# Altium schematic sheet 10_Clock_data_ref.SchDoc: Clock data reference
size A3; Organization: Lime Microsystems; Address1: Surrey Tech Centre; Address2: Guildford GU2 7YG; Address3: Surrey; Address4: United Kingdom; Revision: v1.0; SheetNumber: 10; SheetTotal: 11
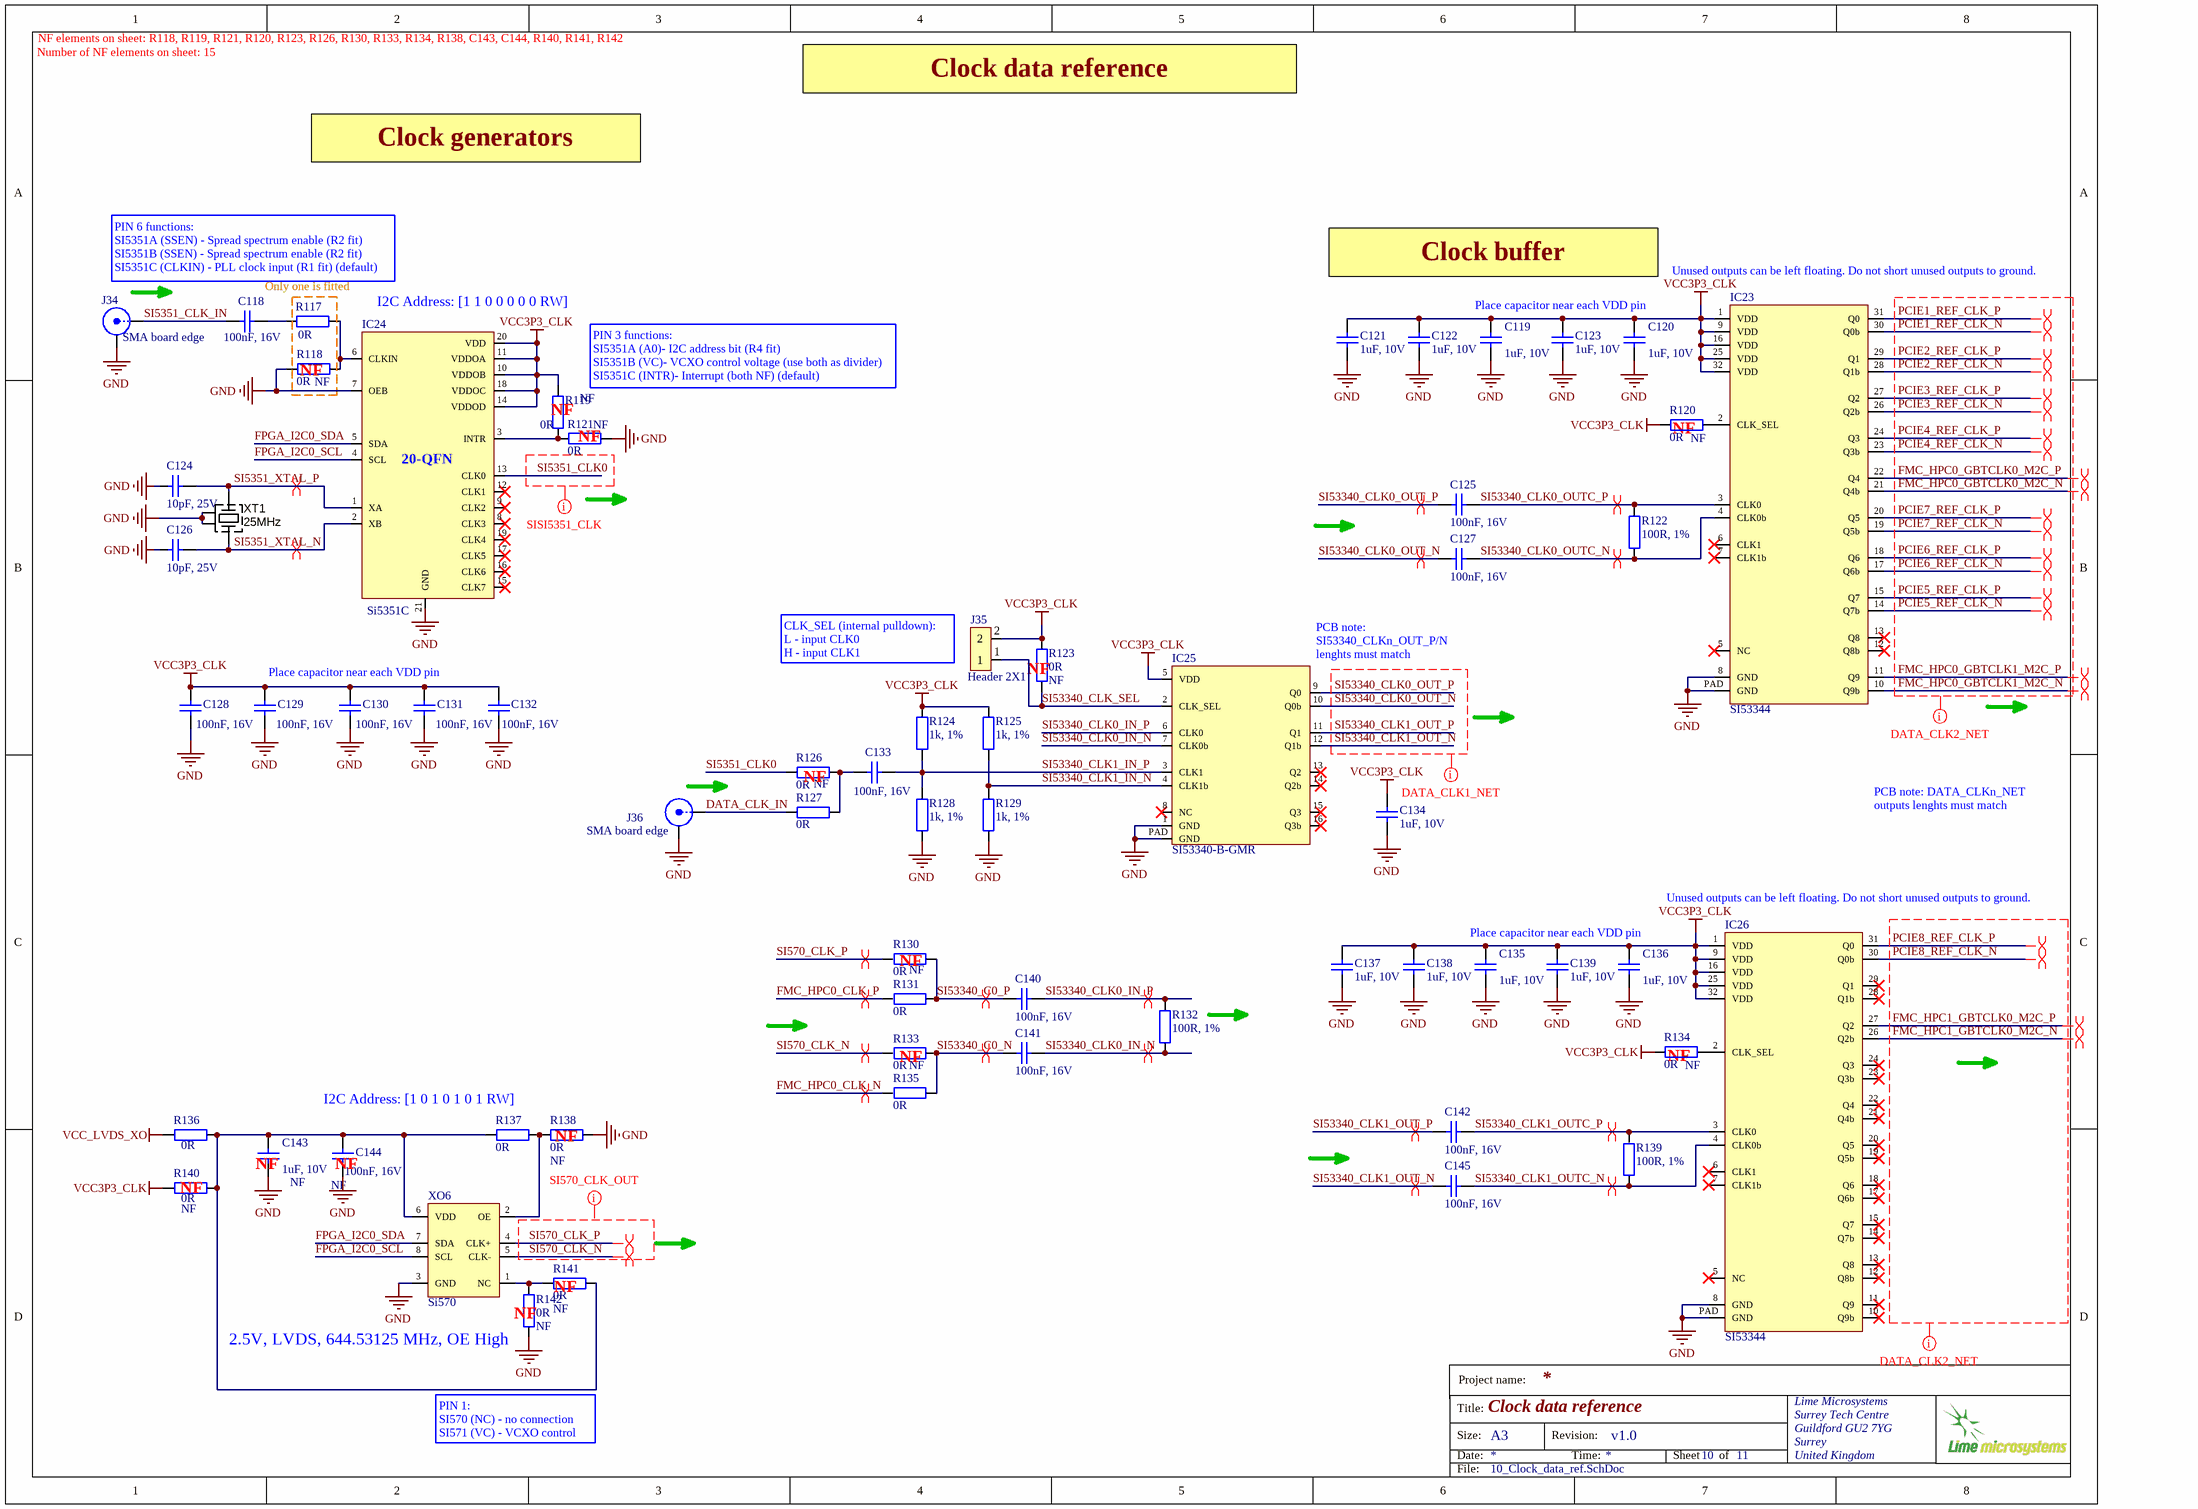
[diagram p0: 10_Clock_data_ref.SchDoc]

## Parts
C118  100nF, 16V  [CAP0402]
C119  1uF, 10V  [CAP0402]
C120  1uF, 10V  [CAP0402]
C121  1uF, 10V  [CAP0402]
C122  1uF, 10V  [CAP0402]
C123  1uF, 10V  [CAP0402]
C124  10pF, 25V  [CAP0402]
C125  100nF, 16V  [CAP0402]
C126  10pF, 25V  [CAP0402]
C127  100nF, 16V  [CAP0402]
C128  100nF, 16V  [CAP0402]
C129  100nF, 16V  [CAP0402]
C130  100nF, 16V  [CAP0402]
C131  100nF, 16V  [CAP0402]
C132  100nF, 16V  [CAP0402]
C133  100nF, 16V  [CAP0402]
C134  1uF, 10V  [CAP0402]
C135  1uF, 10V  [CAP0402]
C136  1uF, 10V  [CAP0402]
C137  1uF, 10V  [CAP0402]
C138  1uF, 10V  [CAP0402]
C139  1uF, 10V  [CAP0402]
C140  100nF, 16V  [CAP0402]
C141  100nF, 16V  [CAP0402]
C142  100nF, 16V  [CAP0402]
C143  1uF, 10V  Assembly Info: NF  [CAP0402]
C144  100nF, 16V  Assembly Info: NF  [CAP0402]
C145  100nF, 16V  [CAP0402]
IC23  SI53344  [SI53344-B-GM_32-VFQFN]
IC24  Si5351C  [Si5351C_20QFN]
IC25  SI53340-B-GMR  [SI53340_QFN16]
IC26  SI53344  [SI53344-B-GM_32-VFQFN]
J34  SMA board edge  [SMA_connector_board_edge_SM]
J35  Header 2X1  [HDR_1x2]
J36  SMA board edge  [SMA_connector_board_edge_SM]
R117  0R  [RES0402]
R118  0R  Assembly Info: NF  [RES0402]
R119  0R  Assembly Info: NF  [RES0402]
R120  0R  Assembly Info: NF  [RES0402]
R121  0R  Assembly Info: NF  [RES0402]
R122  100R, 1%  [RES0402]
R123  0R  Assembly Info: NF  [RES0402]
R124  1k, 1%  [RES0402]
R125  1k, 1%  [RES0402]
R126  0R  Assembly Info: NF  [RES0402]
R127  0R  [RES0402]
R128  1k, 1%  [RES0402]
R129  1k, 1%  [RES0402]
R130  0R  Assembly Info: NF  [RES0402]
R131  0R  [RES0402]
R132  100R, 1%  [RES0402]
R133  0R  Assembly Info: NF  [RES0402]
R134  0R  Assembly Info: NF  [RES0402]
R135  0R  [RES0402]
R136  0R  [RES0402]
R137  0R  [RES0402]
R138  0R  Assembly Info: NF  [RES0402]
R139  100R, 1%  [RES0402]
R140  0R  Assembly Info: NF  [RES0402]
R141  0R  Assembly Info: NF  [RES0402]
R142  0R  Assembly Info: NF  [RES0402]
XO6  Si570  [Si570_Si571_CRYSTAL_8SMD]
XT1  25MHz  [CRYSTAL_4-LCC]

## Nets
GND: C119.1 C120.1 C121.2 C122.2 C123.2 C124.1 C126.1 C128.2 C129.2 C130.2 C131.2 C132.2 C134.2 C135.1 C136.1 C137.2 C138.2 C139.2 C143.1 C144.2 IC23.8(GND) IC23.PAD(GND) IC24.7(OEB) IC24.21(GND) IC25.1(GND) IC25.PAD(GND) IC26.8(GND) IC26.PAD(GND) J34.2(Y) J36.2(Y) R118.2 R121.2 R128.1 R129.1 R138.1 R142.1 XO6.3(GND) XT1.2(GND) XT1.4(GND)
VCC3P3_CLK: C119.2 C120.2 C121.1 C122.1 C123.1 C128.1 C129.1 C130.1 C131.1 C132.1 C134.1 C135.2 C136.2 C137.1 C138.1 C139.1 IC23.1(VDD) IC23.9(VDD) IC23.16(VDD) IC23.25(VDD) IC23.32(VDD) IC24.10(VDDOB) IC24.11(VDDOA) IC24.14(VDDOD) IC24.18(VDDOC) IC24.20(VDD) IC25.5(VDD) IC26.1(VDD) IC26.9(VDD) IC26.16(VDD) IC26.25(VDD) IC26.32(VDD) J35.2 R119.2 R120.1 R123.1 R124.1 R125.1 R134.1 R140.2
VCC_LVDS_XO: R136.2
DATA_CLK_IN: J36.1(X) R127.2
FMC_HPC0_CLK_N: R135.2
FMC_HPC0_CLK_P: R131.2
FMC_HPC0_GBTCLK0_M2C_N: IC23.21(Q4b)
FMC_HPC0_GBTCLK0_M2C_P: IC23.22(Q4)
FMC_HPC0_GBTCLK1_M2C_N: IC23.10(Q9b)
FMC_HPC0_GBTCLK1_M2C_P: IC23.11(Q9)
FMC_HPC1_GBTCLK0_M2C_N: IC26.26(Q2b)
FMC_HPC1_GBTCLK0_M2C_P: IC26.27(Q2)
FPGA_I2C0_SCL: IC24.4(SCL) XO6.8(SCL)
FPGA_I2C0_SDA: IC24.5(SDA) XO6.7(SDA)
PCIE1_REF_CLK_N: IC23.30(Q0b)
PCIE1_REF_CLK_P: IC23.31(Q0)
PCIE2_REF_CLK_N: IC23.28(Q1b)
PCIE2_REF_CLK_P: IC23.29(Q1)
PCIE3_REF_CLK_N: IC23.26(Q2b)
PCIE3_REF_CLK_P: IC23.27(Q2)
PCIE4_REF_CLK_N: IC23.23(Q3b)
PCIE4_REF_CLK_P: IC23.24(Q3)
PCIE5_REF_CLK_N: IC23.14(Q7b)
PCIE5_REF_CLK_P: IC23.15(Q7)
PCIE6_REF_CLK_N: IC23.17(Q6b)
PCIE6_REF_CLK_P: IC23.18(Q6)
PCIE7_REF_CLK_N: IC23.19(Q5b)
PCIE7_REF_CLK_P: IC23.20(Q5)
PCIE8_REF_CLK_N: IC26.30(Q0b)
PCIE8_REF_CLK_P: IC26.31(Q0)
SI570_CLK_N: R133.2 XO6.5(CLK-)
SI570_CLK_P: R130.2 XO6.4(CLK+)
SI5351_CLK0: IC24.13(CLK0) R126.2
SI5351_CLK_IN: C118.1 J34.1(X)
SI5351_XTAL_N: C126.2 IC24.2(XB) XT1.3(X)
SI5351_XTAL_P: C124.2 IC24.1(XA) XT1.1(X)
SI53340_C0_N: C141.1 R133.1 R135.1
SI53340_C0_P: C140.1 R130.1 R131.1
SI53340_CLK0_IN_N: C141.2 IC25.7(CLK0b) R132.1
SI53340_CLK0_IN_P: C140.2 IC25.6(CLK0) R132.2
SI53340_CLK0_OUT_N: C127.1 IC25.10(Q0b)
SI53340_CLK0_OUT_P: C125.1 IC25.9(Q0)
SI53340_CLK0_OUTC_N: C127.2 IC23.4(CLK0b) R122.1
SI53340_CLK0_OUTC_P: C125.2 IC23.3(CLK0) R122.2
SI53340_CLK1_IN_N: IC25.4(CLK1b) R125.2 R129.2
SI53340_CLK1_IN_P: C133.2 IC25.3(CLK1) R124.2 R128.2
SI53340_CLK1_OUT_N: C145.1 IC25.12(Q1b)
SI53340_CLK1_OUT_P: C142.1 IC25.11(Q1)
SI53340_CLK1_OUTC_N: C145.2 IC26.4(CLK0b) R139.1
SI53340_CLK1_OUTC_P: C142.2 IC26.3(CLK0) R139.2
SI53340_CLK_SEL: IC25.2(CLK_SEL) J35.1 R123.2
NetC118_2: C118.2 R117.1
NetC133_1: C133.1 R126.1 R127.1
NetC143_2: C143.2 C144.1 R136.1 R137.2 R140.1 R141.1 XO6.6(VDD)
NetIC23_2: IC23.2(CLK_SEL) R120.2
NetIC24_3: IC24.3(INTR) R119.1 R121.1
NetIC24_6: IC24.6(CLKIN) R117.2 R118.1
NetIC26_2: IC26.2(CLK_SEL) R134.2
NetR137_1: R137.1 R138.2 XO6.2(OE)
NetR141_2: R141.2 R142.2 XO6.1(NC)

Not connected (* = marked no-connect by the designer): IC23 5(NC)* 6(CLK1)* 7(CLK1b)* 12(Q8b)* 13(Q8)*; IC24 8(CLK3)* 9(CLK2)* 12(CLK1)* 15(CLK7)* 16(CLK6)* 17(CLK5)* 19(CLK4)*; IC25 8(NC)* 13(Q2)* 14(Q2b)* 15(Q3)* 16(Q3b)*; IC26 5(NC)* 6(CLK1)* 7(CLK1b)* 10(Q9b)* 11(Q9)* 12(Q8b)* 13(Q8)* 14(Q7b)* 15(Q7)* 17(Q6b)* 18(Q6)* 19(Q5b)* 20(Q5)* 21(Q4b)* 22(Q4)* 23(Q3b)* 24(Q3)* 28(Q1b)* 29(Q1)*

## Layout directives
differential pair: FMC_HPC0_CLK_N, FMC_HPC0_CLK_P, FMC_HPC0_GBTCLK0_M2C_N, FMC_HPC0_GBTCLK0_M2C_P, FMC_HPC0_GBTCLK1_M2C_N, FMC_HPC0_GBTCLK1_M2C_P, FMC_HPC1_GBTCLK0_M2C_N, FMC_HPC1_GBTCLK0_M2C_P, PCIE1_REF_CLK_N, PCIE1_REF_CLK_P, PCIE2_REF_CLK_N, PCIE2_REF_CLK_P, PCIE3_REF_CLK_N, PCIE3_REF_CLK_P, PCIE4_REF_CLK_N, PCIE4_REF_CLK_P, PCIE5_REF_CLK_N, PCIE5_REF_CLK_P, PCIE6_REF_CLK_N, PCIE6_REF_CLK_P, PCIE7_REF_CLK_N, PCIE7_REF_CLK_P, PCIE8_REF_CLK_N, PCIE8_REF_CLK_P, SI570_CLK_N, SI570_CLK_P, SI5351_XTAL_N, SI5351_XTAL_P, SI53340_C0_N, SI53340_C0_P, SI53340_CLK0_IN_N, SI53340_CLK0_IN_P, SI53340_CLK0_OUT_N, SI53340_CLK0_OUT_P, SI53340_CLK0_OUTC_N, SI53340_CLK0_OUTC_P, SI53340_CLK1_OUT_N, SI53340_CLK1_OUT_P, SI53340_CLK1_OUTC_N, SI53340_CLK1_OUTC_P
net class SI_CLK: (no net found under the mark), SI5351_CLK0
net class DATA_CLK1_NET: SI53340_CLK0_OUT_N, SI53340_CLK0_OUT_P, SI53340_CLK1_OUT_N, SI53340_CLK1_OUT_P
net class DATA_CLK2_NET: FMC_HPC0_GBTCLK0_M2C_N, FMC_HPC0_GBTCLK0_M2C_P, FMC_HPC0_GBTCLK1_M2C_N, FMC_HPC0_GBTCLK1_M2C_P, FMC_HPC1_GBTCLK0_M2C_N, FMC_HPC1_GBTCLK0_M2C_P, PCIE1_REF_CLK_N, PCIE1_REF_CLK_P, PCIE2_REF_CLK_N, PCIE2_REF_CLK_P, PCIE3_REF_CLK_N, PCIE3_REF_CLK_P, PCIE4_REF_CLK_N, PCIE4_REF_CLK_P, PCIE5_REF_CLK_N, PCIE5_REF_CLK_P, PCIE6_REF_CLK_N, PCIE6_REF_CLK_P, PCIE7_REF_CLK_N, PCIE7_REF_CLK_P, PCIE8_REF_CLK_N, PCIE8_REF_CLK_P

## Notes on the sheet
- NF elements on sheet: R118, R119, R121, R120, R123, R126, R130, R133, R134, R138, C143, C144, R140, R141, R142
- Number of NF elements on sheet: 15
- Clock data reference
- Clock generators
- PIN 6 functions:
  SI5351A (SSEN) - Spread spectrum enable (R2 fit)
  SI5351B (SSEN) - Spread spectrum enable (R2 fit)
  SI5351C (CLKIN) - PLL clock input (R1 fit) (default)
- Only one is fitted
- I2C Address: [1 1 0 0 0 0 0 RW]
- Clock buffer
- Place capacitor near each VDD pin
- (near IC23) Unused outputs can be left floating. Do not short unused outputs to ground.
- (near R118) NF
- PIN 3 functions:
  SI5351A (A0)- I2C address bit (R4 fit)
  SI5351B (VC)- VCXO control voltage (use both as divider)
  SI5351C (INTR)- Interrupt (both NF) (default)
- (near R119) NF
- (near R121) NF
- (near R120) NF
- CLK_SEL (internal pulldown):
  L - input CLK0
  H - input CLK1
- (near R123) NF
- (near IC25) PCB note: SI53340_CLKn_OUT_P/N lenghts must match
- (near R126) NF
- PCB note: DATA_CLKn_NET outputs lenghts must match
- (near IC26) Unused outputs can be left floating. Do not short unused outputs to ground.
- (near R130) NF
- I2C Address: [1 0 1 0 1 0 1 RW]
- (near R133) NF
- (near R134) NF
- (near R140) NF
- (near C143) NF
- (near C144) NF
- (near R138) NF
- (near R142) NF
- (near R141) NF
- (near R142) 2.5V, LVDS, 644.53125 MHz, OE High
- PIN 1:
  SI570 (NC) - no connection
  SI571 (VC) - VCXO control
- Project name:
- Title:
- Size:
- Date:
- A3
- Revision:
- Time:
- Sheet
- of
- File:
- (in symbol Si5351C) 20-QFN

## Library data of the parts
C118 C125 C127-C133 C140-C142 C144 C145 = Cap_0603: Manufacturer Part Number 1: GRM155R71C104KA88D; Part Description: 0.10µF ±10% 16V X7R Ceramic Capacitor -55°C ~ 125°C Surface Mount, MLCC 0402 (1005 Metric) 0.039" L x 0.020" W (1.00mm x 0.50mm); Brand: Murata Electronics; Tolerance: 10 %; Type: General Purpose MLCC; Capacitance: 0.1 uF; Temperature Coefficient / Code: +/- 15 %; Supplier 1: Mouser; Supplier Part Number 1: 81-GRM155R71C104KA88; Case Code - in: 0402; Manufacturer: Murata Electronics; Category: Multilayer Ceramic Capacitors MLCC - SMD/SMT; Voltage Rating DC: 16 V; Value: 100nF, 16V; Manufacturer Part Number: GRM155R71C104KA88D
C119-C123 C134-C139 C143 = Cap_0402: CAP CER 1UF 10V X5R 0402; Manufacturer: Yageo; Part Description: 1µF 10V Ceramic Capacitor X5R 0402 (1005 Metric) 0.039" L x 0.020" W (1.00mm x 0.50mm); Manufacturer Part Number 1: CC0402MRX5R6BB105; Notification: Current market demand for these product types have resulted in fluctuating and extending lead times. Lead times may differ.; Tolerance: ±20%; Value: 1uF, 10V; Supplier 1: Digi-Key; Supplier Part Number 1: 311-1732-1-ND; RoHS: RoHS Compliant; Applications: General Purpose; Category: Capacitors; ComponentLink1Description: http://www.yageo.com/documents/recent/UPY-GPHC_X5R_4V-to-50V_25.pdf; ComponentLink1URL: http://www.yageo.com/documents/recent/UPY-GPHC_X5R_4V-to-50V_25.pdf; Failure Rate: -; Features: -; Height - Seated (Max): -; Lead Spacing: -; Lead Style: -; Mounting Type: Surface Mount, MLCC; Operating Temperature: -55°C ~ 85°C; Package / Case: 0402 (1005 Metric); Packaging: Cut Tape (CT); Part Status: Active; Pricing 1: 1=0.22, 10=0.156, 100=0.0732, 500=0.0513, 1000=0.04248, 2500=0.03953, 5000=0.03617 (USD); Ratings: -; Size / Dimension: 0.039" L x 0.020" W (1.00mm x 0.50mm); Stock 1: 69600; Temperature Coefficient: X5R; Thickness (Max): 0.022" (0.55mm); Voltage - Rated: 10V
C124 C126 = Cap_0402: Manufacturer: AVX; Part Description: 10pF ±5% 25V C0G, NP0 Ceramic Capacitor -55°C ~ 125°C Surface Mount, MLCC 0402 (1005 Metric) 0.039" L x 0.020" W (1.00mm x 0.50mm); Manufacturer Part Number 1: 04023A100JAT2A; Capacitance: 10; Ceramic Capacitor Case: 0402 [1005 Metric]; Capacitance Tolerance: ± 5%; Supplier 1: Farnell; Supplier Part Number 1: 2332478RL; value: 10pF, 25V
IC23 IC26 = SI53344: Manufacturer: Skyworks Solutions; Manufacturer Part Number 1: SI53344-B-GM; Part Description: Clock Fanout Buffer (Distribution), Multiplexer IC 2:10 1.25 GHz 32-VFQFN Exposed Pad; Supplier 1: Digi-Key; Supplier Part Number 1: 336-3842-ND; Stock 1: 4927; Pricing 1: 1=4,47000, 10=4,01100, 25=3,79200, 80=3,28650, 230=3,11800, 490=2,79776, 980=2,38500 (USD); RoHS: No
IC24 = Si5351C: Manufacturer Part Number 1: SI5351C-B-GM; Part Description: IC CLK GENERATOR 200MHZ 20QFN; Manufacturer: Silicon Labs; Voltage - Supply: 1.71 V ~ 3.6 V; Input: Clock, Crystal; Ratio - Input:Output: 2:8; Frequency - Max: 160MHz; Supplier 1: Digi-Key; Supplier Device Package: 20-QFN (4x4); Type: Clock Generator; Package / Case: 20-VFQFN Exposed Pad; Category: Integrated Circuits (ICs); Supplier Part Number 1: 336-2402-ND
IC25 = SI53340-B-GMR: Clock Fanout Buffer (Distribution), Multiplexer IC 2:4 1.25 GHz 16-VFQFN Exposed Pad; Manufacturer: Skyworks Solutions; Part Description: 2: 4 LVDS buffer (1.25GHz), 2: 1 input mux, (QFN16), footprint compatible: CDCLVP1204; Supplier 1: Digi-Key; Manufacturer Part Number 1: SI53340-B-GMR; Stock 1: 17153; Pricing 1: 1=3,29, 10=2,952, 25=2,7904, 100=2,4184, 250=2,29436, 500=2,05874 (USD); RoHS: No; Supplier Part Number 1: 336-4763-1-ND
J34 J36 = RF_IF_connector: CONN SMA JACK STR 50OHM EDGE MNT; Manufacturer: RF Solutions; Manufacturer Part Number 1: CON-SMA-EDGE-S; Part Description: SMA Connector Jack, Female Socket Board Edge, End Launch Solder; Connector Type: Jack, Female Socket; Contact Termination: Solder; Supplier 1: Digi-Key; Supplier Part Number 1: CON-SMA-EDGE-S-ND; RoHS: RoHS Compliant; Category: Connectors, Interconnects; Stock 1: 1751; Pricing 1: 1=2.1 (USD); Packaging: -; Part Status: Active; Connector Style: SMA; Shield Termination: Solder; Impedance: -; Mounting Type: Board Edge, End Launch; Mounting Feature: -; Cable Group: -; Fastening Type: Threaded; Frequency - Max: -; Features: -; Housing Color: -; Ingress Protection: -; Includes: -; Body Material: -; Body Finish: -; Center Contact Plating: -; Dielectric Material: -; Operating Temperature: -; Center Contact Material: -; Voltage Rating: -; Mating Cycles: -; Insertion Loss: -; ComponentLink1URL: http://media.digikey.com/pdf/Data%20Sheets/RF%20Solutions%20PDFs/CON-SMA-EDGE.pdf; ComponentLink1Description: http://media.digikey.com/pdf/Data%20Sheets/RF%20Solutions%20PDFs/CON-SMA-EDGE.pdf
J35 = Jumper: Manufacturer Part Number 1: 961102-6404-AR; Part Description: 2 Positions Header, Unshrouded Connector 0.100" (2.54mm) Through Hole Gold; Manufacturer: 3M; Connector Type: Header, Unshrouded; Supplier 1: Digi-Key; Supplier Part Number 1: 3M9447-ND; Contact Type: Male Pin; Color: Black; Mounting Type: Through Hole; Category: Connectors, Interconnects; Contact Finish: Gold
R117-R121 R123 R126 R127 R130 R131 R133-R138 R140-R142 = Res_0402: Manufacturer Part Number 1: RC0402JR-070RL; Manufacturer: Yageo; Part Description: RES SMD 0.0OHM JUMPER 1/16W 0402; Resistance (Ohms): 0.0; Tolerance: Jumper; Power (Watts): 0.063W, 1/16W; Value: 0R; Supplier 1: Digi-Key; Supplier Part Number 1: 311-0.0JRTR-ND; Category: Resistors; Temperature Coefficient: -; Features: Moisture Resistant; Supplier Device Package: 0402; Height: 0.016" (0.40mm); Package / Case: 0402 (1005 Metric); Operating Temperature: -55°C ~ 155°C; Size / Dimension: 0.039" L x 0.020" W (1.00mm x 0.50mm); Composition: Thick Film; Packaging: Tape & Reel (TR); Number of Terminations: 2; RoHS: RoHS Compliant
R122 R132 R139 = Res_0402: Manufacturer Part Number 1: RMCF0402FT100R; Part Description: RES SMD 100 OHM 1% 1/16W 0402; Manufacturer: Stackpole Electronics Inc.; Temperature Coefficient: ±100ppm/°C; Supplier 1: Digi-Key; Supplier Part Number 1: RMCF0402FT100RDKR-ND; Package / Case: 0402 (1005 Metric); Composition: Thick Film; Category: Resistors; Tolerance: ±1%; Value: 100R, 1%
R124 R125 R128 R129 = Res_0402: Manufacturer: Stackpole Electronics Inc; Manufacturer Part Number 1: RMCF0402FT1K00; Part Description: RES SMD 1K OHM 1% 1/16W 0402; Temperature Coefficient: ±100ppm/°C; Power (Watts): 0.063W, 1/16W; Value: 1k, 1%; Supplier 1: Digi-Key; Supplier Part Number 1: RMCF0402FT1K00TR-ND; Resistance (Ohms): 1k; Packaging: Tape & Reel (TR); Category: Resistors; RoHS: RoHS Compliant; Tolerance: ±1%; Height: 0.016" (0.40mm); Number of Terminations: 2; Package / Case: 0402 (1005 Metric); Operating Temperature: -55°C ~ 155°C; Features: -; Composition: Thick Film; Supplier Device Package: 0402; Size / Dimension: 0.039" L x 0.020" W (1.00mm x 0.50mm)
XO6 = SI570: Part Description: 644.53125 MHz XO (Standard) LVDS Oscillator 2.5V Enable/Disable (Reprogrammable) 8-SMD, No Lead; Manufacturer: Silicon Labs; Manufacturer Part Number 1: 570FAA000759DGR; ComponentLink1URL: https://datasheet.ciiva.com/9287/si570-9287030.pdf?src-supplier=Avnet; ComponentLink1Description: https://datasheet.ciiva.com/9287/si570-9287030.pdf?src-supplier=Avnet; Supplier 1: Digi-Key; Supplier Part Number 1: 336-5616-1-ND; Stock 1: 165; Pricing 1: 100=63,45320 (USD); RoHS: Yes
XT1 = CRYSTAL_19M2: Oscillator Crystal 25 MHz; Manufacturer Part Number 1: ABM8-25.000MHZ-B2-T; Manufacturer: ABRACON; Part Description: 25MHz ±20ppm Crystal 18pF 50 Ohm -20°C ~ 70°C Surface Mount 4-SMD, No Lead (DFN, LCC); Supplier 1: Newark; Supplier Part Number 1: 13J1767